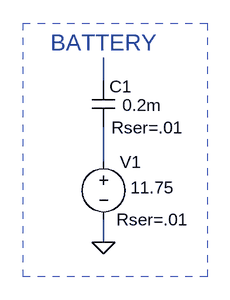
[diagram p0: schematic battery.asc]
battery.asc, the LTspice schematic file:
Version 4
SHEET 1 880 680
WIRE 176 80 176 48
WIRE 176 192 176 144
WIRE 176 304 176 272
FLAG 176 304 0
SYMBOL voltage 176 176 R0
WINDOW 3 37 52 Left 2
WINDOW 123 24 138 Left 2
WINDOW 39 18 97 Left 2
WINDOW 0 23 17 Left 2
SYMATTR Value 11.75
SYMATTR SpiceLine Rser=.01
SYMATTR InstName V1
SYMBOL cap 160 80 R0
WINDOW 3 42 34 Left 2
WINDOW 39 27 65 Left 2
WINDOW 40 24 98 Left 2
SYMATTR Value 0.2m
SYMATTR SpiceLine Rser=.01
SYMATTR InstName C1
TEXT 176 48 Bottom 3 ;BATTERY
RECTANGLE Normal 320 352 64 0 2

The netlist it stands for:
* battery.asc
V1 N002 0 11.75 Rser=.01
C1 N001 N002 0.2m Rser=.01
* BATTERY
.backanno
.end